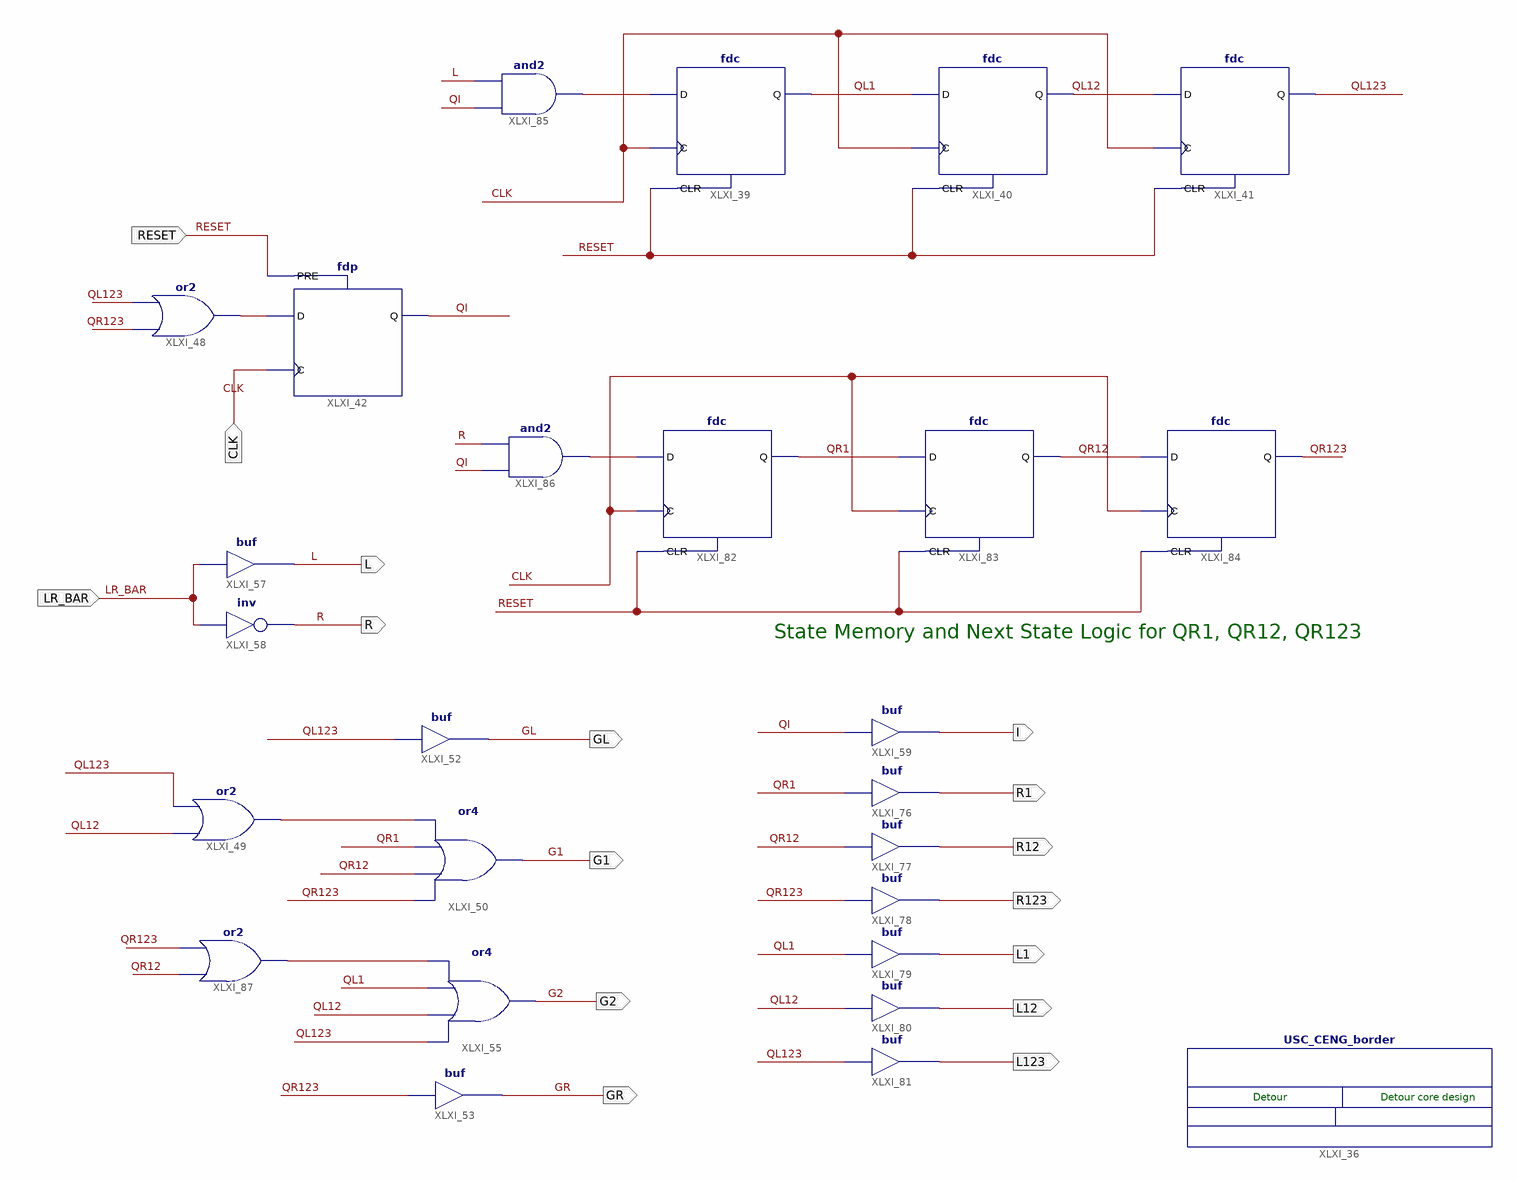
[diagram p0: schematic sheet 1]
// Xilinx ISE schematic ee201l_detour.sch (spartan6) as structural Verilog: 26 symbols, 16 ports
module ee201l_detour (
  input  LR_BAR,
  input  CLK,
  input  RESET,
  output L123,
  output L12,
  output L1,
  output R123,
  output R12,
  output R1,
  output I,
  output GL,
  output GR,
  output G2,
  output G1,
  output R,
  output L
);

  wire QI, QL1, QL12, QL123, QR1, QR12, QR123, XLXN_160, XLXN_174, XLXN_210, XLXN_211, XLXN_214;

  USC_CENG_border XLXI_36 ();
  buf XLXI_81 (L123, QL123);
  buf XLXI_80 (L12, QL12);
  buf XLXI_79 (L1, QL1);
  buf XLXI_78 (R123, QR123);
  buf XLXI_77 (R12, QR12);
  buf XLXI_76 (R1, QR1);
  buf XLXI_59 (I, QI);
  or XLXI_55 (G2, QL123, QL12, QL1, XLXN_210);
  or XLXI_49 (XLXN_174, QL12, QL123);
  buf XLXI_53 (GR, QR123);
  buf XLXI_52 (GL, QL123);
  or XLXI_50 (G1, QR123, QR12, QR1, XLXN_174);
  not XLXI_58 (R, LR_BAR);
  buf XLXI_57 (L, LR_BAR);
  or XLXI_48 (XLXN_160, QR123, QL123);
  fdp XLXI_42 (.C(CLK), .D(XLXN_160), .PRE(RESET), .Q(QI));
  fdc XLXI_41 (.C(CLK), .CLR(RESET), .D(QL12), .Q(QL123));
  fdc XLXI_40 (.C(CLK), .CLR(RESET), .D(QL1), .Q(QL12));
  fdc XLXI_39 (.C(CLK), .CLR(RESET), .D(XLXN_211), .Q(QL1));
  fdc XLXI_82 (.C(CLK), .CLR(RESET), .D(XLXN_214), .Q(QR1));
  fdc XLXI_83 (.C(CLK), .CLR(RESET), .D(QR1), .Q(QR12));
  fdc XLXI_84 (.C(CLK), .CLR(RESET), .D(QR12), .Q(QR123));
  and XLXI_85 (XLXN_211, QI, L);
  and XLXI_86 (XLXN_214, QI, R);
  or XLXI_87 (XLXN_210, QR12, QR123);

  // Notes on the sheet:
  //   State Memory and Next State Logic for QR1, QR12, QR123
  //   Detour
  //   Detour core design
endmodule
